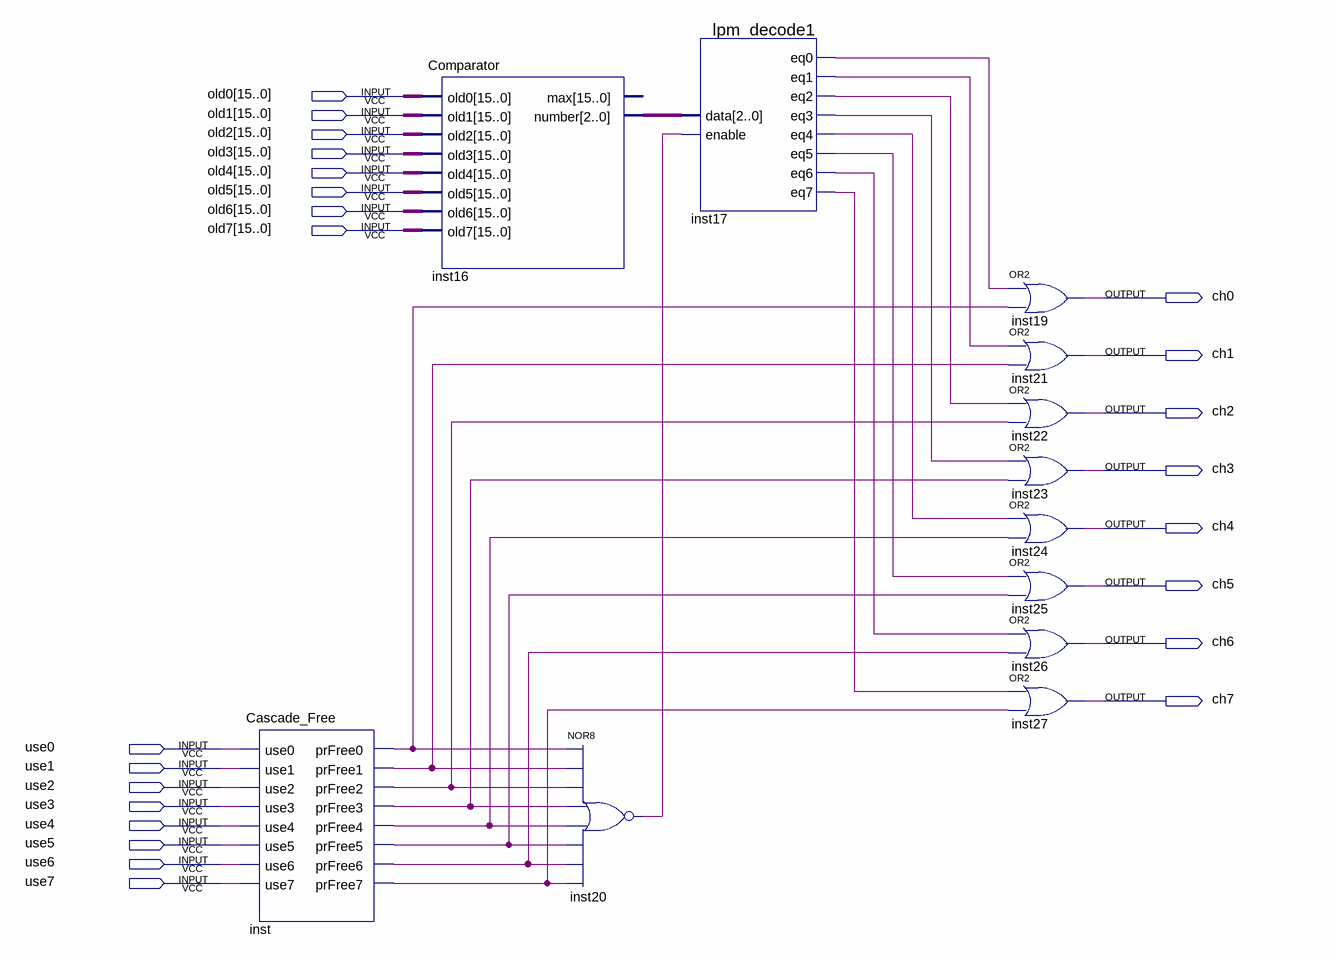
[diagram p0: schematic sheet]
// Quartus schematic Cash_Analyze.bdf as structural Verilog: 12 symbols, 24 pins
module Cash_Analyze (
  input  [15:0] old0,
  input  [15:0] old1,
  input  [15:0] old2,
  input  [15:0] old3,
  input  [15:0] old4,
  input  [15:0] old5,
  input  [15:0] old6,
  input  [15:0] old7,
  input  use0,
  input  use1,
  input  use2,
  input  use3,
  input  use4,
  input  use5,
  input  use6,
  input  use7,
  output ch0,
  output ch1,
  output ch2,
  output ch3,
  output ch4,
  output ch5,
  output ch6,
  output ch7
);

  wire inst17_eq0, inst17_eq1, inst17_eq2, inst17_eq3, inst17_eq4, inst17_eq5, inst17_eq6, inst17_eq7,
       inst20_out, inst_prfree0, inst_prfree1, inst_prfree2, inst_prfree3, inst_prfree4, inst_prfree5,
       inst_prfree6, inst_prfree7;
  wire [2:0] inst16_number;

  Cascade_Free inst (
    .use0(use0), .use1(use1), .use2(use2), .use3(use3), .use4(use4), .use5(use5), .use6(use6), .use7(use7),
    .prFree0(inst_prfree0), .prFree1(inst_prfree1), .prFree2(inst_prfree2), .prFree3(inst_prfree3),
    .prFree4(inst_prfree4), .prFree5(inst_prfree5), .prFree6(inst_prfree6), .prFree7(inst_prfree7));
  Comparator inst16 (
    .old0(old0), .old1(old1), .old2(old2), .old3(old3), .old4(old4), .old5(old5), .old6(old6), .old7(old7),
    .number(inst16_number));  // open: max
  nor inst20 (inst20_out, inst_prfree0, inst_prfree1, inst_prfree2, inst_prfree3, inst_prfree4, inst_prfree5, inst_prfree6, inst_prfree7);
  lpm_decode1 inst17 (
    .data(inst16_number), .enable(inst20_out), .eq0(inst17_eq0), .eq1(inst17_eq1), .eq2(inst17_eq2),
    .eq3(inst17_eq3), .eq4(inst17_eq4), .eq5(inst17_eq5), .eq6(inst17_eq6), .eq7(inst17_eq7));
  or inst19 (ch0, inst17_eq0, inst_prfree0);
  or inst21 (ch1, inst17_eq1, inst_prfree1);
  or inst22 (ch2, inst17_eq2, inst_prfree2);
  or inst23 (ch3, inst17_eq3, inst_prfree3);
  or inst24 (ch4, inst17_eq4, inst_prfree4);
  or inst25 (ch5, inst17_eq5, inst_prfree5);
  or inst26 (ch6, inst17_eq6, inst_prfree6);
  or inst27 (ch7, inst17_eq7, inst_prfree7);
endmodule
